# EAGLE design WirelessTRV (EAGLE 6.4)
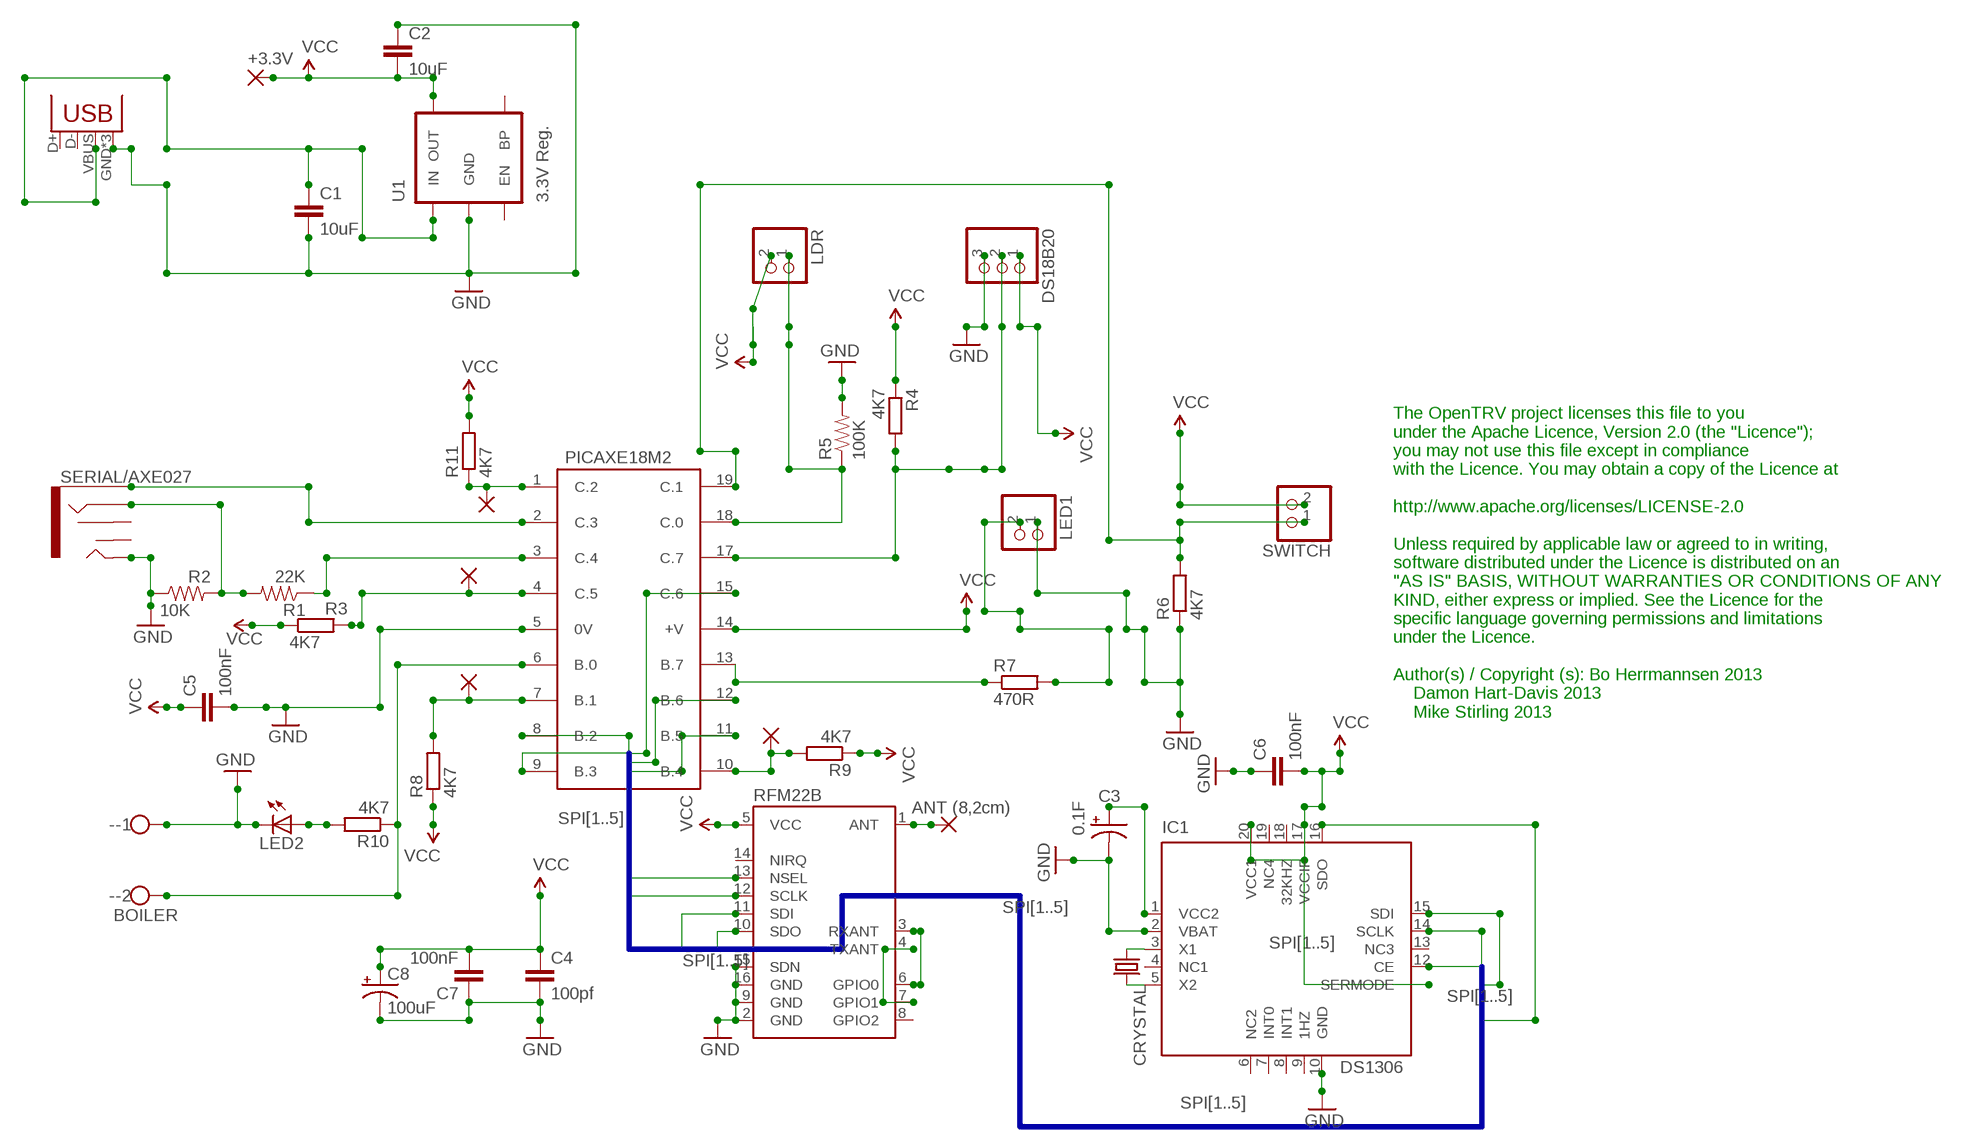
[diagram p0: schematic, sheet 1]

## Parts
1  2,15/1,0  [2,15/1,0]
4  2,15/1,0  [2,15/1,0]
5V  USB-MICROB  [USB-MICROB]
7  2,15/1,0  [2,15/1,0]
10  2,15/1,0  [2,15/1,0]
+3.3V  2,15/1,0  [2,15/1,0]
-  BOILER  W237-102  [W237-102]
ANT  ANT (8,2cm)  2,15/1,0  [2,15/1,0]
C1  10uF  CAP0603-CAP  [0603-CAP]
C2  10uF  CAP0603-CAP  [0603-CAP]
C3  0.1F  SUPERCAP3.6VSUPERCAP3.6V  [SUPERCAP3.6V]
C4  100pf  CAP0603-CAP  [0603-CAP]
C5  100nF  CAP0603-CAP  [0603-CAP]
C6  100nF  CAP0603-CAP  [0603-CAP]
C7  100nF  CAP0603-CAP  [0603-CAP]
C8  100uF  CAP_POL1206  [EIA3216]
CRYSTAL  CSM-7X-DU  [CSM-7X-DU]
DS18B20  PINHD-1X3  [1X03]
IC1  DS1306  [DS1306]
LDR  PINHD-1X2  [1X02]
LED1  PINHD-1X2  [1X02]
LED2  PL006-WCR12  [SOT23]
PICAXE18M2  PICAXE18M2  [PICAXE18M2]
R1  22K  RESISTOR0805-RES  [0805]
R2  10K  RESISTOR0603-RES  [0603-RES]
R3  4K7  R-EU_M0805  [M0805]
R4  4K7  R-EU_M0805  [M0805]
R5  100K  RESISTOR1206  [1206]
R6  4K7  R-EU_M0805  [M0805]
R7  470R  R-EU_R0603  [R0603]
R8  4K7  R-EU_M0805  [M0805]
R9  4K7  R-EU_M0805  [M0805]
R10  4K7  R-EU_M0805  [M0805]
R11  4K7  R-EU_M0805  [M0805]
RFM22B  RFM22SMD  [RFM22-XXX-S2]
SERIAL/AXE027  AUDIO-JACK2SMD  [AUDIO-JACK-3.5MM-SMD]
SWITCH  PINHD-1X2  [1X02]
U1  3.3V Reg.  V_REG_LDOSMD  [SOT23-5]

## Nets
GND: 5V.GND 5V.MT1(GND) 5V.MT2(GND) -.1 C1.2 C2.1 C3.- C4.2 C5.2 C6.1 C7.1 C8.C(-) DS18B20.3 IC1.2(VBAT) IC1.10(GND) LED1.1 LED2.3(C) PICAXE18M2.5(0V) R2.1 R5.2 R6.1 RFM22B.2(GND) RFM22B.9(GND) RFM22B.15(SDN) RFM22B.16(GND) SERIAL/AXE027.TIP U1.2(GND)
N$1: 10.1(P) PICAXE18M2.10(B.4) R9.2
N$2: CRYSTAL.1 IC1.3(X1)
N$3: 4.1(P) PICAXE18M2.4(C.5) R3.2
N$4: 5V.VBUS C1.1 U1.1(IN)
N$5: PICAXE18M2.2(C.3) SERIAL/AXE027.SLEEVE
N$6: PICAXE18M2.3(C.4) R1.1
N$7: R1.2 R2.2 SERIAL/AXE027.RING
N$8: PICAXE18M2.13(B.7) R7.1
N$9: LED2.1(A) R10.2
N$10: -.2 PICAXE18M2.6(B.0) R10.1
N$11: 1.1(P) PICAXE18M2.1(C.2) R11.1
N$13: LED1.2 R7.2
N$14: PICAXE18M2.19(C.1) R6.2 SWITCH.1
N$15: 7.1(P) PICAXE18M2.7(B.1) R8.2
N$16: CRYSTAL.2 IC1.5(X2)
N$17: LDR.1 PICAXE18M2.18(C.0) R5.1
N$18: DS18B20.2 PICAXE18M2.17(C.7) R4.2
N$20: RFM22B.3(RXANT) RFM22B.6(GPIO0)
N$21: RFM22B.4(TXANT) RFM22B.7(GPIO1)
N$26: ANT.1(P) RFM22B.1(ANT)
N$28: C3.+ IC1.1(VCC2)
SPI1: IC1.14(SCLK) PICAXE18M2.8(B.2) RFM22B.12(SCLK)
SPI2: IC1.15(SDI) PICAXE18M2.9(B.3) RFM22B.10(SDO)
SPI3: IC1.16(SDO) PICAXE18M2.15(C.6) RFM22B.11(SDI)
SPI4: PICAXE18M2.11(B.5) RFM22B.13(NSEL)
SPI5: IC1.12(CE) PICAXE18M2.12(B.6)
VCC: +3.3V.1(P) C2.2 C4.1 C5.1 C6.2 C7.2 C8.A(+) DS18B20.1 IC1.11(SERMODE) IC1.17(VCCIF) IC1.20(VCC1) LDR.2 PICAXE18M2.14(+V) R3.1 R4.1 R8.1 R9.1 R11.2 RFM22B.5(VCC) SWITCH.2 U1.5(OUT)
Unconnected: 5V.D+ 5V.D- IC1.4(NC1) IC1.6(NC2) IC1.7(INT0) IC1.8(INT1) IC1.13(NC3) RFM22B.8(GPIO2) RFM22B.14(NIRQ) SERIAL/AXE027.RSH SERIAL/AXE027.TSH U1.3(EN) U1.4(BP)

## Buses
SPI[1..5]

## Notes on the sheet
- The OpenTRV project licenses this file to you
  under the Apache Licence, Version 2.0 (the "Licence");
  you may not use this file except in compliance
  with the Licence. You may obtain a copy of the Licence at
  
  http://www.apache.org/licenses/LICENSE-2.0
  
  Unless required by applicable law or agreed to in writing,
  software distributed under the Licence is distributed on an
  "AS IS" BASIS, WITHOUT WARRANTIES OR CONDITIONS OF ANY
  KIND, either express or implied. See the Licence for the
  specific language governing permissions and limitations
  under the Licence.
  
  Author(s) / Copyright (s): Bo Herrmannsen 2013
      Damon Hart-Davis 2013
      Mike Stirling 2013

## Power pins joined to a net without a drawn wire
1HZ: IC1.9(1HZ)
32KHZ: IC1.18(32KHZ)
NC4: IC1.19(NC4)

## Library data of the parts
1 4 7 10 +3.3V ANT = wirepad:2,15/1,0: THROUGH-HOLE PAD
5V = SparkFun-Connectors:USB: USB Connectors USB-B-PTH is fully proven SKU : PRT-00139 USB-miniB is fully proven SKU : PRT-00587 USB-A-PCB is untested. USB-A-H is throughly reviewed, but untested. Spark Fun Electronics SKU : PRT-00437 USB-B-SMT is throughly reviewed, but untested. Needs silkscreen touching up. USB-A-S has not been used/tested USB-MB-H has not been used/tested
- = con-wago-500:W237-102: WAGO SCREW CLAMP; MPN: 237-102; OC_FARNELL: unknown; OC_NEWARK: 70K9898
C1 C2 C4-C7 = SparkFun-Passives:CAP: Capacitor Standard 0603 ceramic capacitor, and 0.1" leaded capacitor.
C3 = supwecap3.6v:SUPERCAP3.6V: Capacitor Polarized These are standard SMD and PTH capacitors. Normally 10uF, 47uF, and 100uF in electrolytic and tantalum varieties. Always verify the external diameter of the through hole cap, it varies with capacity, voltage, and manufacturer. The EIA devices should be standard.
C8 = SparkFun-Passives:CAP_POL: Capacitor Polarized These are standard SMD and PTH capacitors. Normally 10uF, 47uF, and 100uF in electrolytic and tantalum varieties. Always verify the external diameter of the through hole cap, it varies with capacity, voltage, and manufacturer. The EIA devices should be standard.
CRYSTAL = crystal:CSM-7X-DU: SMD CRYSTAL Source: www.ecsxtal.com .. Crystal 3.6864MHz CSM_7X_DU.PDF; OC_FARNELL: unknown; OC_NEWARK: unknown
DS18B20 = pinhead:PINHD-1X3: PIN HEADER
IC1 = DS1306:DS1306: HART Modem Single-Chip, Half-Duplex, 1200bps FSK Modulation and Demodulation Source: http://datasheets.maxim-ic.com/en/ds/DS8500.pdf
LDR LED1 SWITCH = pinhead:PINHD-1X2: PIN HEADER
LED2 = led:PL006*: PLH006 Series SMD LED SOT23 PLH006-WCR21 Super Red PLH006-WCR12 High Eff Red PLH006-WCG13 Green PLH006-WCY01 Yellow www.p-tec.net Source: http://www.wittig-electronic.de/PTEC/PL006Series.pdf
PICAXE18M2 = picaxe18m2:PICAXE18M2
R1 R2 R5 = SparkFun-Passives:RESISTOR: Resistor Basic schematic elements and footprints for 0603, 1206, and PTH resistors.
R3 R4 R6-R11 = resistor:R-EU_: RESISTOR, European symbol
RFM22B = SparkFun-RF:RFM22: The RFM22 is a low-power, low cost radio that is capable of operating in the 434MHz and 900MHz open bands. It's frequency is software defined and there are some very good libraries written for it.
SERIAL/AXE027 = SparkFun-Connectors:AUDIO-JACK2: Stereo audio jack with bypass switches.
U1 = SparkFun-PowerIC:V_REG_LDO: Voltage Regulator LDO Standard 150mA LDO voltage regulator in SOT-23 layout. Micrel part MIC5205. BP (by-pass) pin is used to lower output noise with 470pF cap.

## Board
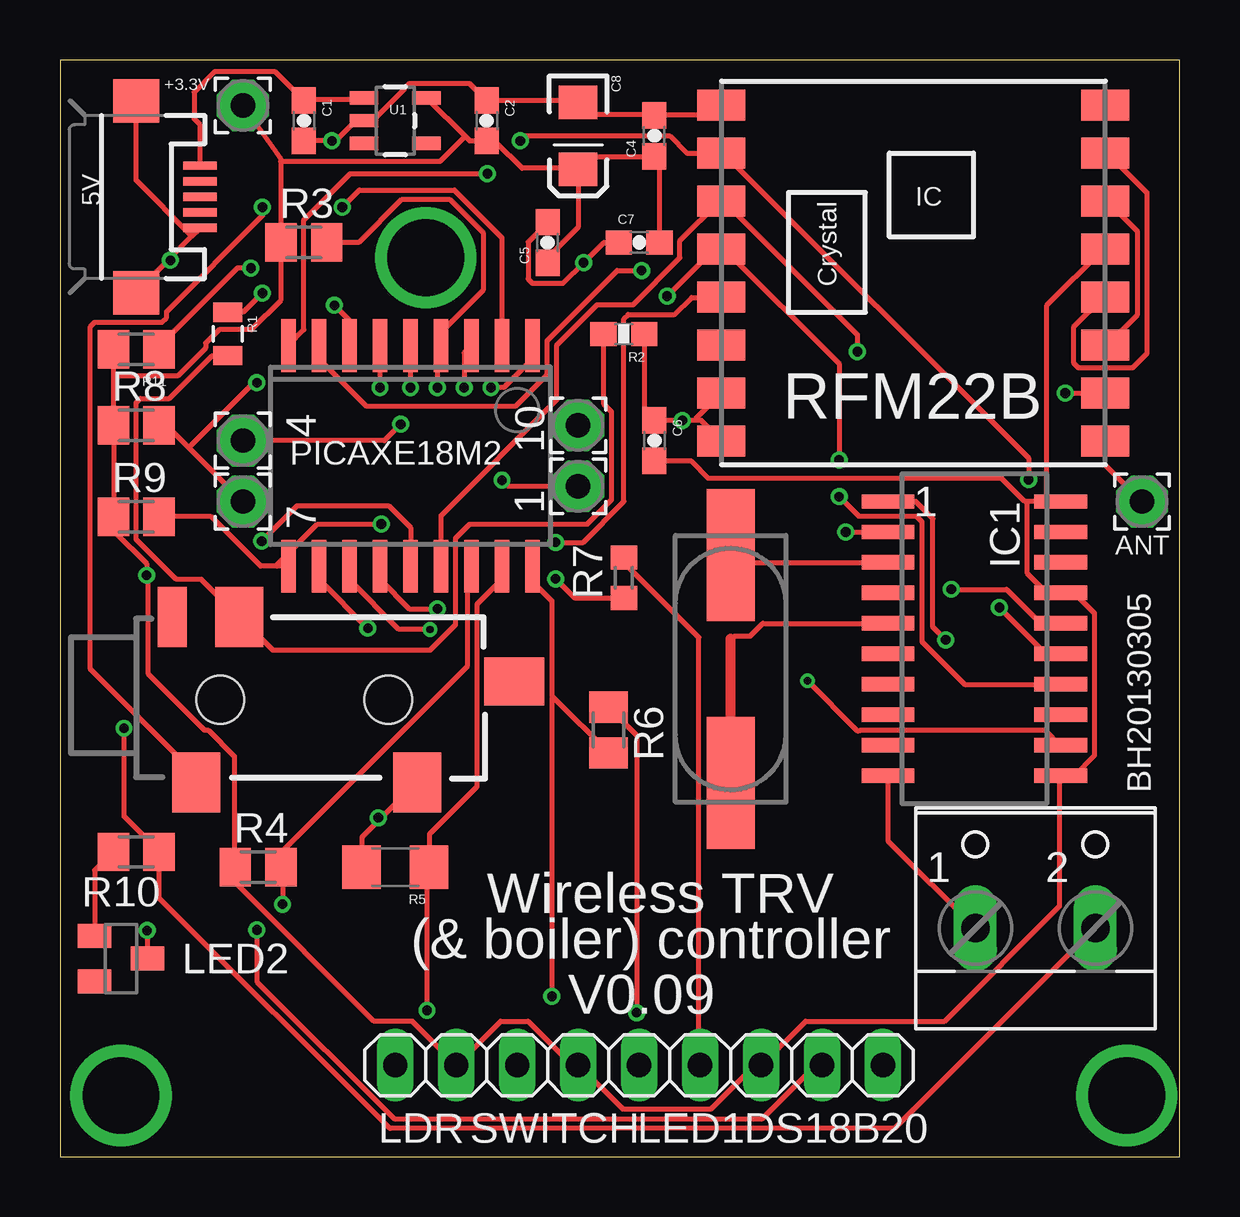
[diagram p1: board, top side]
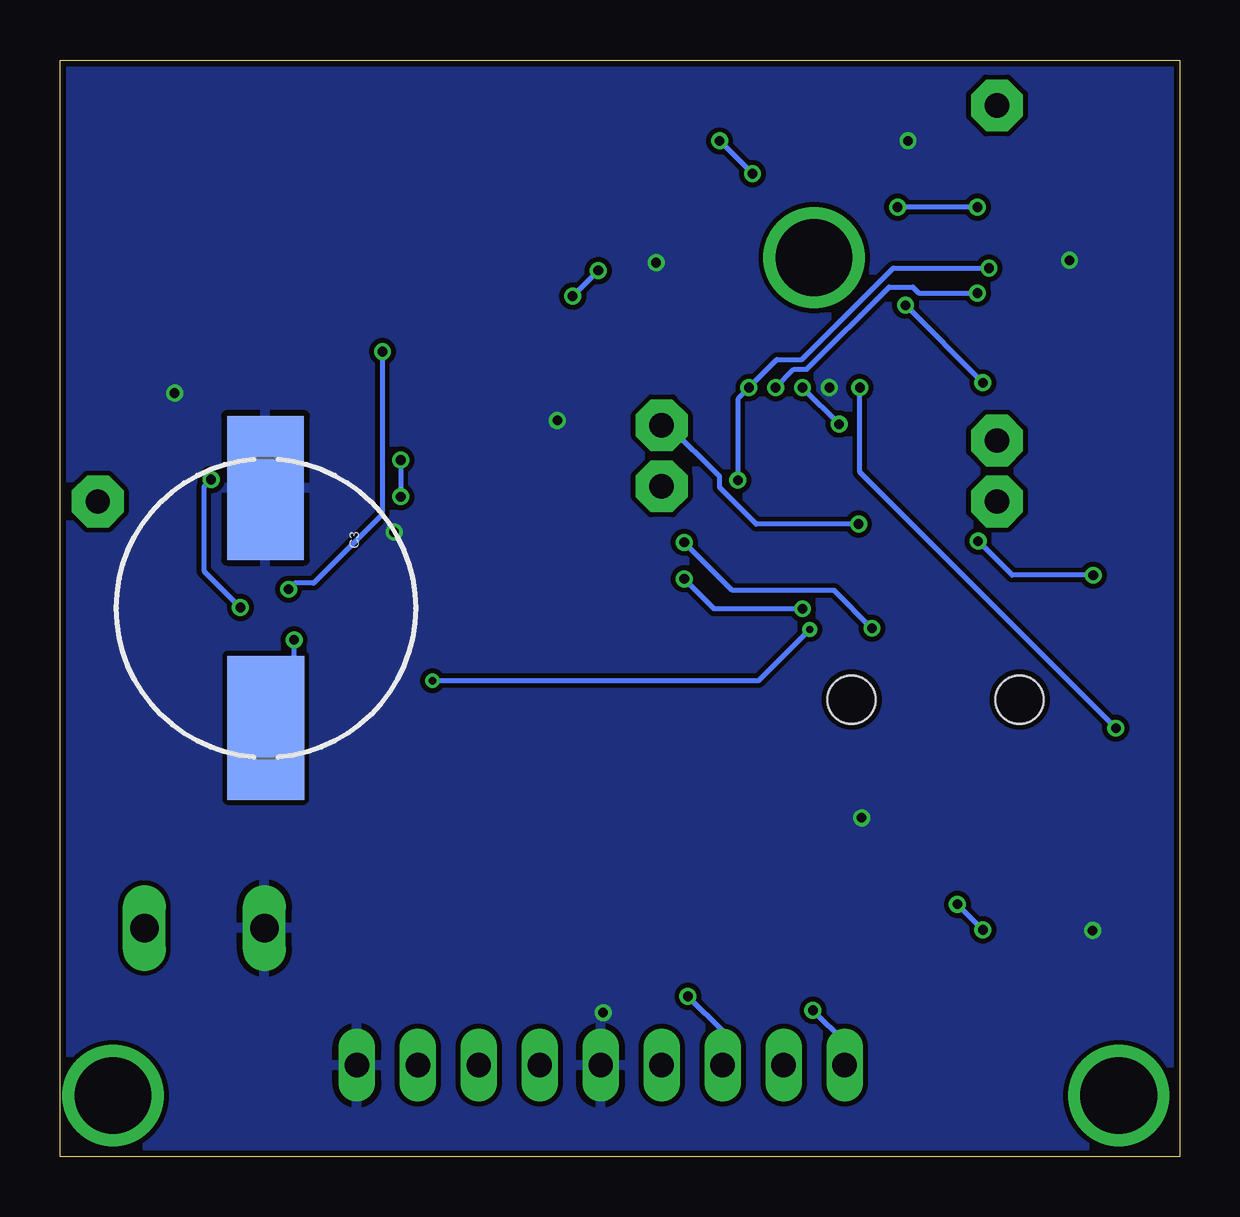
[diagram p2: board, bottom side, seen from below]

Size 46.66 x 45.71 mm. Coordinates in mm from the lower left corner, seen from the top.
Outline: 0,0 46.66,0 46.66,45.71 0,45.71 0,0
Copper layers (1*16): Top 0.035mm / dielectric 1.5mm / Bottom 0.035mm
Design rules "PMServicesStd": minimum track width 8mil, minimum drill 12mil, track to track 8mil, track to pad 8mil, pad to pad 8mil, via to via 8mil, smd to smd 0mil, copper to edge 10mil, drill to drill 10mil, minimum pad ring 10mil, minimum via ring 6mil, stop-mask expansion 2mil, vias tented up to drill 100mil, thermal gap 10mil

### Footprints (pad centres in the part's own frame; a part is rotated, then mirrored left to right if it is on the bottom)
2,15/1,0 = drill 1.016 pad 2.159 octagon: 1 0,0
USB-MICROB = smd 0.35 x 1.4: D+ 0,2.65; D- -0.65,2.65; GND 1.3,2.65; ID 0.65,2.65; VBUS -1.3,2.65 | smd 1.8 x 1.9: MT1 -4,0; MT2 4,0
W237-102 = drill 1.194 long: 1 -2.5,-1.27; 2 2.5,-1.27
0603-CAP = smd 1.1 x 1: 1 -0.85,0; 2 0.85,0
SUPERCAP3.6V = smd 6 x 3.2: + 4.99,0.01; - -5.01,0
EIA3216 = smd 1.4 x 1.6: A 1.4,0; C -1.4,0
CSM-7X-DU = smd 5.5 x 2: 1 -4.75,0; 2 4.75,0
1X03 = drill 1.016 long: 1 -2.54,0; 2 0,0; 3 2.54,0
DS1306 = smd 0.6 x 2.2: 1 -5.715,-3.6; 2 -4.445,-3.6; 3 -3.175,-3.6; 4 -1.905,-3.6; 5 -0.635,-3.6; 6 0.635,-3.6; 7 1.905,-3.6; 8 3.175,-3.6; 9 4.445,-3.6; 10 5.715,-3.6; 11 5.715,3.6; 12 4.445,3.6; 13 3.175,3.6; 14 1.905,3.6; 15 0.635,3.6; 16 -0.635,3.6; 17 -1.905,3.6; 18 -3.175,3.6; 19 -4.445,3.6; 20 -5.715,3.6
1X02 = drill 1.016 long: 1 -1.27,0; 2 1.27,0
SOT23 = smd 1 x 1.4: 1 -0.95,-1.1; 2 0.95,-1.1; 3 0,1.1
PICAXE18M2 = smd 0.6 x 2.2: 1 -5.715,-4.6; 2 -4.445,-4.6; 3 -3.175,-4.6; 4 -1.905,-4.6; 5 -0.635,-4.6; 6 0.635,-4.6; 7 1.905,-4.6; 8 3.175,-4.6; 9 4.445,-4.6; 10 4.445,4.6; 11 3.175,4.6; 12 1.905,4.6; 13 0.635,4.6; 14 -0.635,4.6; 15 -1.905,4.6; 17 -3.175,4.6; 18 -4.445,4.6; 19 -5.715,4.6
0805 = smd 0.8 x 1.2: 1 -0.9,0; 2 0.9,0
0603-RES = smd 1.1 x 1: 1 -0.85,0; 2 0.85,0
M0805 = smd 1.3 x 1.6: 1 -0.95,0; 2 0.95,0
1206 = smd 1.6 x 1.8: 1 -1.4,0; 2 1.4,0
R0603 = smd 1 x 1.1: 1 -0.85,0; 2 0.85,0
RFM22-XXX-S2 = smd 2 x 1.3: 1 -8,7; 2 -8,5; 3 -8,3; 4 -8,1; 5 -8,-1; 6 -8,-3; 7 -8,-5; 8 -8,-7; 9 8,-7; 10 8,-5; 11 8,-3; 12 8,-1; 13 8,1; 14 8,3; 15 8,5; 16 8,7
AUDIO-JACK-3.5MM-SMD = smd 2 x 2.5: RING 4.3,3.45; SLEEVE 2.5,-3.45; TIP 11.7,-3.45 | smd 1.2 x 2.5: RSH 1.5,3.45 | smd 2.5 x 2: TSH 15.75,0.75 | hole 2: 3.5,0; 10.5,0
SOT23-5 = smd 0.55 x 1.2: 1 -0.95,-1.3; 2 0,-1.3; 3 0.95,-1.3; 4 0.95,1.3; 5 -0.95,1.3

### Placement (x,y rotation side)
1  21.59,27.94 90 top
4  7.62,29.84 90 top
5V  3.17,40.01 270 top
7  7.62,27.3 90 top
10  21.59,30.48 90 top
+3.3V  7.62,43.81 0 top
-  40.64,10.79 0 top
ANT  45.09,27.3 180 top
C1  10.16,43.18 270 top
C2  17.78,43.18 270 top
C3  38.1,22.86 270 bottom
C4  24.77,42.55 90 top
C5  20.32,38.1 90 top
C6  24.77,29.84 270 top
C7  24.13,38.1 0 top
C8  21.59,42.55 270 top
CRYSTAL  27.94,20.32 270 top
DS18B20  31.75,3.81 0 top
IC1  38.1,21.59 270 top
LDR  15.24,3.81 0 top
LED1  25.4,3.81 0 top
LED2  2.54,8.26 270 top
PICAXE18M2  13.97,29.21 180 top
R1  6.99,34.29 270 top
R2  23.5,34.29 180 top
R3  10.16,38.1 0 top
R4  8.26,12.06 0 top
R5  13.97,12.06 180 top
R6  22.86,17.78 270 top
R7  23.5,24.13 90 top
R8  3.17,30.48 0 top
R9  3.17,26.67 0 top
R10  3.17,12.7 180 top
R11  3.17,33.66 180 top
RFM22B  35.56,36.83 180 top
SERIAL/AXE027  3.17,19.05 0 top
SWITCH  20.32,3.81 0 top
U1  13.97,43.18 270 top

### Tracks (layer width: path | path; a pad name or v marks a point on that pad's centre or on a via)
GND  (via drill 0.4)
  Top 0.2: RFM22B.9 27.56,43.81 27.15,43.41 C4.2 24.69,43.46 22.1,43.46 21.67,43.89 C8.C 21.59,43.97 21.54,44.02 17.78,44.02 C2.1 17.7,44.09 17.07,44.73 14.55,44.73 14.35,44.53 14.35,44.5 13.08,43.23 12.75,43.23 U1.2 12.32,43.18 11.48,42.34 v11.33,42.34 10.16,42.34 C1.2 | 4.55,37.41 3.17,36.04 5V.MT2 | 4.55,37.41 5.5,38.37 | 5.5,38.37 5.82,38.68 5V.GND | 5V.MT1 3.17,40.69 5.5,38.37 | 26.49,30.68 26.72,30.68 27.56,29.84 RFM22B.16 | 26.49,30.68 v25.93,30.68 24.77,30.68 C6.1 24.71,30.79 24.36,31.14 R2.1 | RFM22B.15 26.49,30.76 26.49,30.68 | 13.32,14.06 14.86,15.6 SERIAL/AXE027.TIP | 13.32,14.06 12.57,13.31 R5.2 | C7.1 22.66,38.1 v21.82,37.26 20.95,36.4 19.68,36.4 19.51,36.58 19.51,38.12 20.32,38.94 C5.2 | v3.63,9.42 LED2.3 | v24.03,5.99 24.03,17.55 R6.1 | v41.88,31.83 43.54,31.83 RFM22B.2 | v14.61,32.05 PICAXE18M2.5 | IC1.10 34.52,15.88 34.52,13.13 38.12,9.53 -.1 | v32.74,26.04 IC1.2 | v13.26,14.12 13.32,14.06 | v4.6,37.36 4.55,37.41
  pour Bottom: 0,45.72 0,0 46.99,0 46.35,45.72
N$1  (via drill 0.4)
  Top 0.2: R9.2 6.3,26.67 8.36,24.61 9.04,24.61 | 9.04,24.61 PICAXE18M2.10 | v13.39,26.36 10.72,26.36 9.04,24.69 9.04,24.61
  Bottom 0.2: 10.1 21.31,30.48 19.18,28.35 19.18,27.89 17.65,26.36 v13.39,26.36
N$2
  Top 0.203: IC1.3 28.25,24.77 CRYSTAL.1 | CRYSTAL.1
N$3  (via drill 0.4)
  Top 0.2: R3.2 12.45,38.1 14.22,39.88 16.26,39.88 17.65,38.48 17.65,36.14 15.88,34.37 PICAXE18M2.4 15.82,33.73 15.72,33.63 v15.72,32.05 | 4.1 13.51,29.84 v14.2,30.53
  Bottom 0.2: v15.72,32.05 v14.2,30.53
N$4
  Top 0.2: U1.1 12.65,44.12 12.57,44.04 10.16,44.04 C1.1 10.08,44.09 8.97,45.21 6.43,45.21 5.59,44.37 5.59,43.26 5.82,43.03 5.82,41.33 5V.VBUS
N$5  (via drill 0.4)
  Top 0.2: PICAXE18M2.2 18.41,38.3 16.43,40.28 12.47,40.28 v11.76,39.57 | v8.43,39.57 8.43,39.22 4.45,35.23 4.45,34.98 4.24,34.77 1.45,34.77 1.27,34.59 1.27,20.32 5.66,15.93 5.66,15.62 SERIAL/AXE027.SLEEVE
  Bottom 0.2: v8.43,39.57 v11.76,39.57
N$6  (via drill 0.4)
  Top 0.2: v8.43,35.99 7.64,35.2 6.99,35.2 R1.1 | v16.84,32.05 16.84,33.5 PICAXE18M2.3
  Bottom 0.2: v8.43,35.99 10.87,35.99 11.12,36.25 12.12,36.25 15.54,32.82 16.08,32.82 v16.84,32.05
N$7
  Top 0.2: R2.2 22.66,34.29 22.66,31.37 22.99,31.04 22.99,27.38 21.97,26.36 17.07,26.36 16.48,25.78 16.48,22.17 15.42,21.11 8.87,21.11 7.49,22.48 SERIAL/AXE027.RING 7.39,22.55 5.89,24.05 4.85,24.05 3.17,25.73 3.17,31.42 3.35,31.6 4.55,31.6 6.33,33.38 6.99,33.38 R1.2
N$8  (via drill 0.4)
  Top 0.2: v20.65,24.08 21.44,23.29 23.5,23.29 R7.1 | v15.72,22.84 14.55,22.84 13.34,24.05 PICAXE18M2.13
  Bottom 0.2: v20.65,24.08 19.41,22.84 v15.72,22.84
N$9
  Top 0.2: LED2.1 1.45,11.94 R10.2
N$10  (via drill 0.4)
  Top 0.2: -.2 43.13,9.53 34.77,1.17 13.74,1.17 4.14,10.77 4.14,12.7 R10.1 4.06,12.78 2.67,14.17 v2.67,17.86 | v13.34,32.05 PICAXE18M2.6
  Bottom 0.2: v13.34,32.05 13.34,28.52 v2.67,17.86
N$11  (via drill 0.4)
  Top 0.2: v7.95,37.03 7.39,37.03 4.14,33.78 4.14,33.66 R11.1 | v17.96,32.05 18.49,32.05 19.68,33.25 PICAXE18M2.1 | 1.1 18.67,27.94 v18.41,28.19
  Bottom 0.2: v7.95,37.03 11.94,37.03 15.75,33.22 16.79,33.22 v17.96,32.05 18.01,31.98 18.41,31.57 v18.41,28.19
N$12  (via drill 3.2)
  other vias: 44.45,2.54
N$13
  Top 0.2: R7.2 23.5,24.77 26.62,21.64 26.62,3.86 LED1.2
N$14  (via drill 0.4)
  Top 0.2: 20.56,19.14 20.5,19.2 20.5,23.16 19.68,23.98 PICAXE18M2.19 | 20.56,19.14 R6.2 | v20.5,6.68 20.5,19.07 20.56,19.14
  Bottom 0.2: SWITCH.1 19.05,5.23 v20.5,6.68
N$15  (via drill 0.4)
  Top 0.2: R8.2 4.45,30.48 5.37,29.55 | 7.1 5.37,29.55 | PICAXE18M2.7 12.06,34.85 v11.43,35.48 | v8.2,32.26 8.08,32.26 5.37,29.55
  Bottom 0.2: v8.2,32.26 v11.43,35.48
N$16
  Top 0.203: IC1.5 29.29,22.23 28.75,21.69 28.12,21.69 27.94,21.59
  Top 0.406: CRYSTAL.2 27.94,21.59
N$17  (via drill 0.4)
  Top 0.2: PICAXE18M2.18 18.41,24.05 17.37,23.01 17.37,15.42 15.39,13.44 15.39,12.06 R5.1 15.29,12.01 v15.29,6.1
  Bottom 0.2: LDR.1 13.97,4.78 v15.29,6.1
N$18  (via drill 0.4)
  Top 0.2: PICAXE18M2.17 17.14,24.59 16.97,24.41 16.97,20.42 9.22,12.68 R4.2 9.27,11.99 v9.27,10.52 | DS18B20.2 31.5,3.81 29.26,1.57 13.92,1.57 8.2,7.29 v8.2,9.45
  Bottom 0.2: v9.27,10.52 v8.2,9.45
N$19  (via drill 3.2)
  other vias: 15.24,37.47
N$20
  Top 0.2: RFM22B.3 43.64,33.83 44.88,35.08 44.88,38.58 43.64,39.83 RFM22B.6
N$21
  Top 0.2: RFM22B.4 43.54,35.81 43.46,35.81 42.24,34.59 42.24,33.07 42.44,32.87 44.68,32.87 45.29,33.48 45.29,40.18 43.66,41.81 43.56,41.81 RFM22B.7
N$22  (via drill 3.2)
  other vias: 2.54,2.54
N$26
  Top 0.2: ANT.1 43.56,28.83 RFM22B.1
N$28  (via drill 0.4)
  Top 0.2: IC1.1 35.66,27.3 36.37,26.59 36.37,22.07 v36.91,21.54
  Bottom 0.2: v36.91,21.54 36.91,19.05 38.08,17.88 C3.+
SPI1  (via drill 0.4)
  Top 0.2: v25.3,35.87 27.25,37.82 RFM22B.12 27.66,37.85 32.46,33.05 v32.46,29.03 | v24.23,36.93 23.22,36.93 20.3,34.01 20.3,32.59 19,31.29 12.75,31.29 10.79,33.25 PICAXE18M2.8 | IC1.14 37.69,19.68 35.92,21.46 35.92,26.47 35.69,26.7 33.27,26.7 v32.46,27.51
  Bottom 0.2: v24.23,36.93 v25.3,35.87 | v32.46,29.03 v32.46,27.51
SPI2  (via drill 0.4)
  Top 0.2: v19.18,42.34 19.38,42.55 25.4,42.55 26.11,41.83 RFM22B.10 27.66,41.81 40.36,29.11 v40.36,28.22 | v17.8,40.97 12.09,40.97 10.16,39.04 10.16,34.47 9.53,33.83 PICAXE18M2.9 | IC1.15 41.07,20.95 v39.14,22.89
  Bottom 0.2: v17.8,40.97 v19.18,42.34 | v39.14,22.89 40.66,24.41 40.66,27.91 v40.36,28.22
SPI3  (via drill 0.4)
  Top 0.2: PICAXE18M2.15 15.88,26.72 20.7,31.55 20.7,33.83 22.38,35.51 23.88,35.51 25.83,37.47 25.83,38.18 27.48,39.83 RFM22B.11 27.66,39.83 33.22,34.27 v33.22,33.55 | IC1.16 40.87,22.23 39.45,23.65 v37.13,23.65
  Bottom 0.2: v37.13,23.65 36.88,23.9 36.09,23.9 33.22,26.77 v33.22,33.55
SPI4  (via drill 0.4)
  Top 0.2: v20.65,25.6 21.79,25.6 23.5,27.3 23.5,34.92 23.67,35.1 25.6,35.1 26.31,35.81 27.56,35.81 RFM22B.13 | v12.83,22.02 10.79,24.05 PICAXE18M2.11
  Bottom 0.2: v20.65,25.6 18.64,23.6 14.4,23.6 v12.83,22.02
SPI5  (via drill 0.3)
  Top 0.2: 33.33,17.75 41.07,17.75 41.68,17.14 IC1.12
  Top 0.203: PICAXE18M2.12 12.06,24.03 14.12,21.97 v15.42,21.97 | v31.14,19.84 33.25,17.73 33.33,17.75
  Bottom 0.203: v15.42,21.97 17.55,19.84 v31.14,19.84
VCC  (via drill 0.4)
  Top 0.2: 40.28,27.3 IC1.20 41.12,27.38 41.12,35.48 43.46,37.82 43.54,37.82 RFM22B.5 | 40.28,27.3 40.21,27.3 39.24,28.27 27.03,28.27 26.31,28.98 C6.2 | 40.28,27.3 40.28,24.33 41.1,23.52 41.6,23.52 IC1.17 42.27,23.5 43.1,22.66 43.1,16.71 42.27,15.88 IC1.11 41.66,15.8 41.66,10.44 36.85,5.64 31.06,5.64 29.29,3.86 DS18B20.1 28.96,3.81 27.13,1.98 23.44,1.98 21.67,3.76 SWITCH.2 21.34,3.81 19.51,5.64 18.36,5.64 16.59,3.86 LDR.2 14.68,5.64 13.08,5.64 7.32,11.4 R4.1 7.26,12.14 7.26,16.69 6.17,17.78 6.02,17.78 3.66,20.14 3.66,24.16 v3.61,24.23 3.61,24.71 2.29,26.04 2.29,26.59 R9.1 2.23,26.67 2.23,30.48 R8.1 2.23,30.56 2.23,32.54 | 2.23,32.54 2.23,33.66 R11.2 | PICAXE18M2.14 14.61,26.21 13.69,27.13 9.88,27.13 v8.41,25.65 | 9.2,41.48 9.2,41.6 +3.3V.1 | 9.2,41.48 9.2,38.1 R3.1 9.2,38.02 9.2,35.69 7.98,34.47 6.63,34.47 6.07,33.91 6.07,33.71 4.9,32.54 2.23,32.54 | 16.88,42.53 15.29,44.12 U1.5 | 16.88,42.53 17.07,42.34 17.78,42.34 C2.2 17.86,42.27 18.19,42.27 19.25,41.2 21.51,41.2 C8.A | C5.1 20.32,37.47 21.59,38.73 C8.A | C8.A 21.67,41.2 22.15,41.68 24.77,41.68 C4.1 24.82,41.6 24.97,41.45 24.97,38.1 C7.2 | 9.2,41.48 15.82,41.48 16.88,42.53
  Bottom 0.2: v8.41,25.65 6.99,24.23 v3.61,24.23

### Text on the board
tNames: BH20130305 | Wireless TRV | (& boiler) controller | V0.09